# EAGLE design Adafruit RGB Matrix FeatherWing (EAGLE 9.0.1)
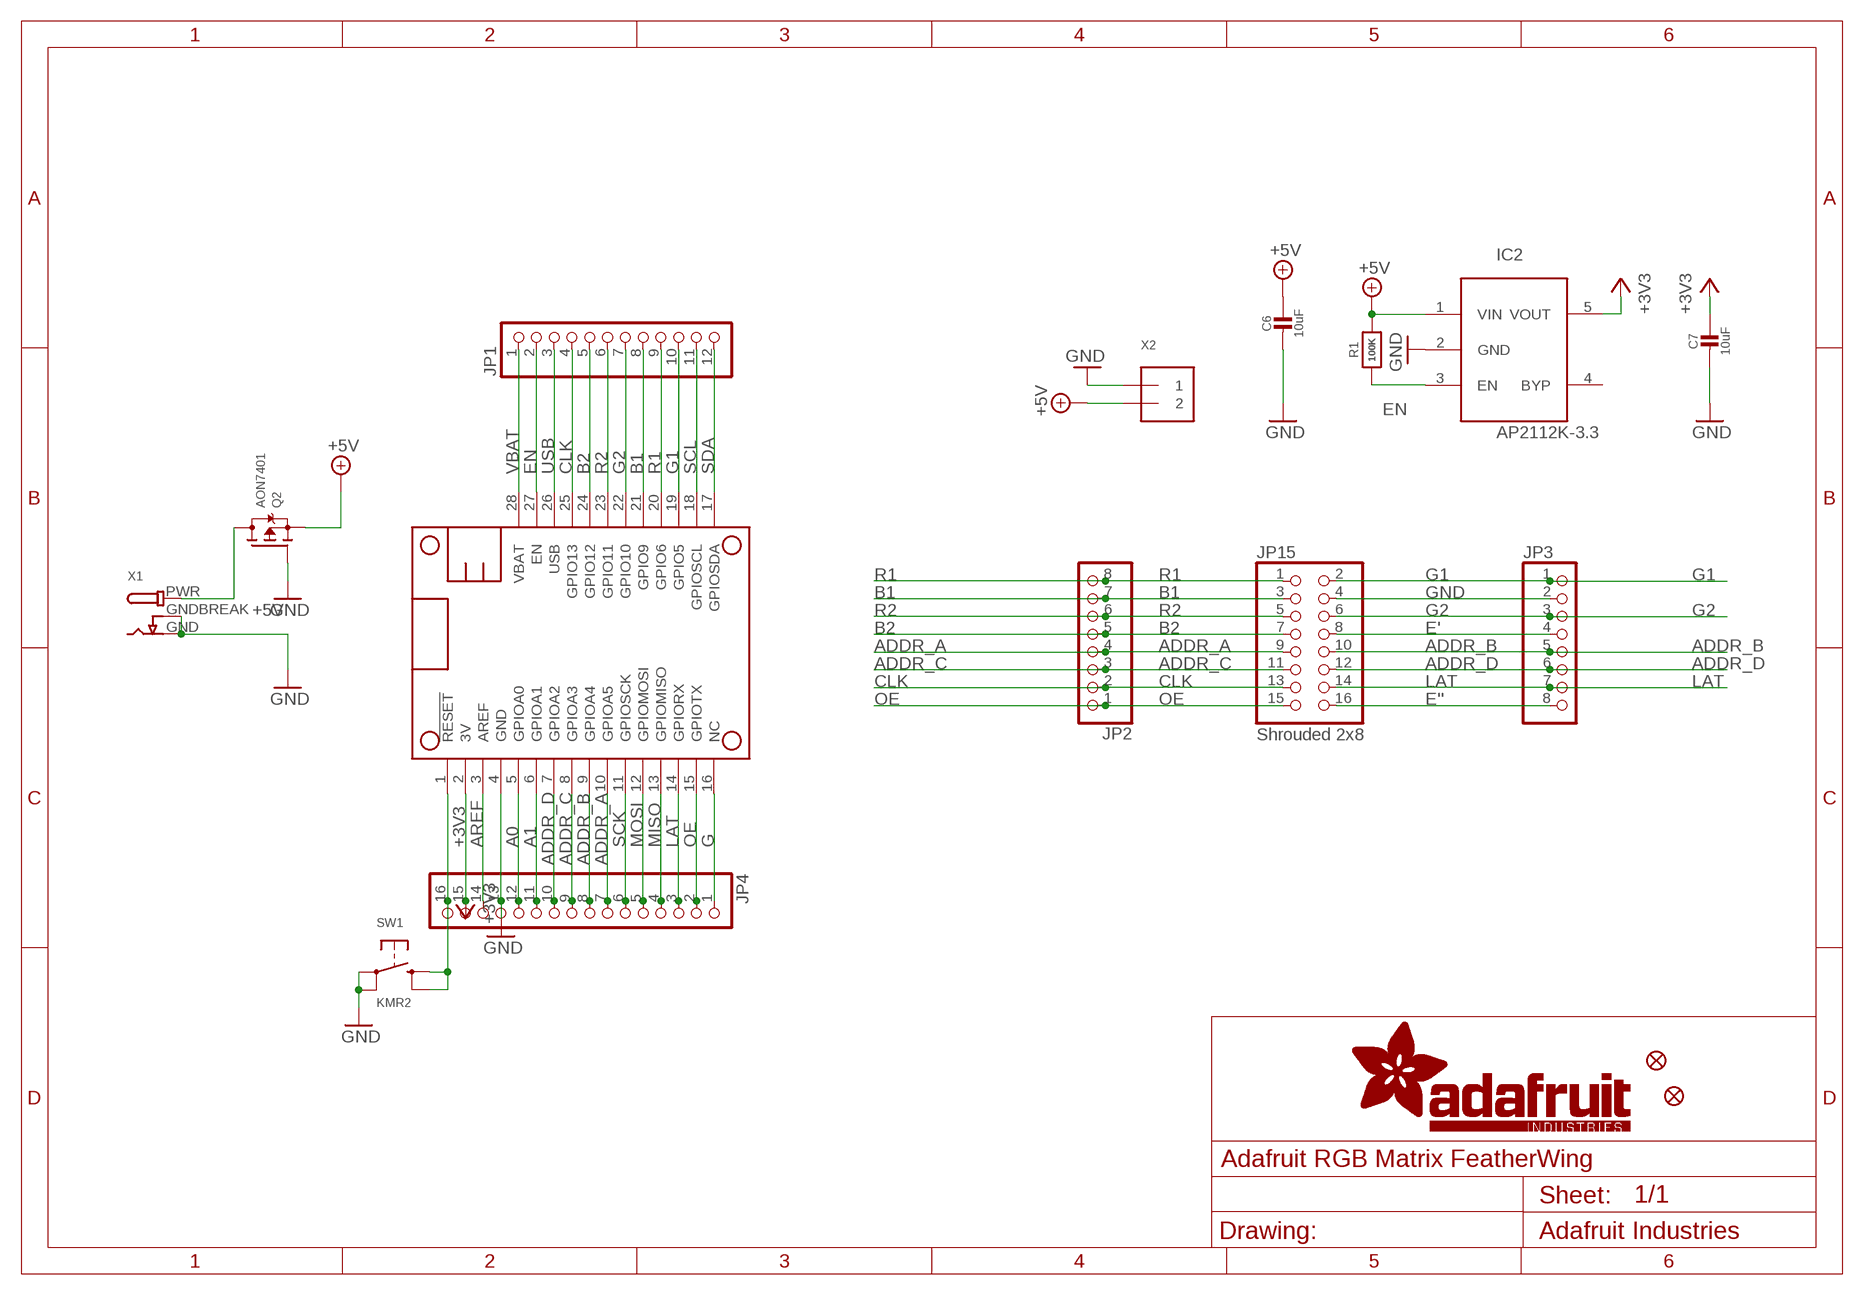
[diagram p0: schematic, sheet 1]

## Parts
C6  10uF  CAP_CERAMIC0805-NOOUTLINE  [0805-NO]
C7  10uF  CAP_CERAMIC0805-NOOUTLINE  [0805-NO]
FID1  FIDUCIAL_1MM  [FIDUCIAL_1MM]
FID3  FIDUCIAL_1MM  [FIDUCIAL_1MM]
IC2  AP2112K-3.3  LP298XS  [SOT23-5L]
JP1  HEADER-1X12  [1X12_ROUND]
JP2  HEADER-1X870MIL  [1X08_ROUND_70]
JP3  HEADER-1X870MIL  [1X08_ROUND_70]
JP4  HEADER-1X16ROUND  [1X16_ROUND]
JP15  Shrouded 2x8  HEADER-2X8_SHROUDED  [2X08_SHROUDED]
MS1  FEATHERWING  [FEATHERWING]
Q2  AON7401  MOSFET-P-POWERDI3333  [POWERDI3333]
R1  100K  RESISTOR_0603_NOOUT  [0603-NO]
SW1  KMR2  SWITCH_TACT_SMT4.6X2.8  [BTN_KMR2_4.6X2.8]
X1  DCBARRELPTH  [DCJACK_2MM_PTH]
X2  TERMBLOCK_1X2_5.08MM  [TERMBLOCK_508_1X2]

## Nets
+3V3 [power]: C7.1 IC2.5(VOUT) JP4.15 MS1.2(3V)
+5V: C6.1 IC2.1(VIN) Q2.1(S) Q2.2(S) Q2.3(S) R1.2 X2.P$4
A0: JP4.12 MS1.5(GPIOA0)
A1: JP4.11 MS1.6(GPIOA1)
ADDR_A: JP2.4 JP4.7 JP15.9 MS1.10(GPIOA5)
ADDR_B: JP3.5 JP4.8 JP15.10 MS1.9(GPIOA4)
ADDR_C: JP2.3 JP4.9 JP15.11 MS1.8(GPIOA3)
ADDR_D: JP3.6 JP4.10 JP15.12 MS1.7(GPIOA2)
AREF: JP4.14 MS1.3(AREF)
B1: JP1.8 JP2.7 JP15.3 MS1.21(GPIO9)
B2: JP1.5 JP2.5 JP15.7 MS1.24(GPIO12)
CLK: JP1.4 JP2.2 JP15.13 MS1.25(GPIO13)
E': JP3.4 JP15.8
E'': JP3.8 JP15.16
EN: IC2.3(EN) JP1.2 MS1.27(EN) R1.1
G: JP4.1 MS1.16(NC)
G1: JP1.10 JP3.1 JP15.2 MS1.19(GPIO5)
G2: JP1.7 JP3.3 JP15.6 MS1.22(GPIO10)
GND: C6.2 C7.2 IC2.2(GND) JP3.2 JP4.13 JP15.4 MS1.4(GND) Q2.4(G) SW1.A'(P1) SW1.A(P) X1.GND X1.GNDBREAK X2.P$3
LAT: JP3.7 JP4.3 JP15.14 MS1.14(GPIORX)
MISO: JP4.4 MS1.13(GPIOMISO)
MOSI: JP4.5 MS1.12(GPIOMOSI)
OE: JP2.1 JP4.2 JP15.15 MS1.15(GPIOTX)
R1: JP1.9 JP2.8 JP15.1 MS1.20(GPIO6)
R2: JP1.6 JP2.6 JP15.5 MS1.23(GPIO11)
RESET: JP4.16 MS1.1(!RESET) SW1.B'(S1) SW1.B(S)
SCK: JP4.6 MS1.11(GPIOSCK)
SCL: JP1.11 MS1.18(GPIOSCL)
SDA: JP1.12 MS1.17(GPIOSDA)
USB: JP1.3 MS1.26(USB)
VBAT: JP1.1 MS1.28(VBAT)
VIN: Q2.5678(D) X1.PWR
Unconnected: IC2.4(BYP)

## Library data of the parts
C6 C7 = microbuilder:CAP_CERAMIC: Ceramic Capacitors For new designs, use the packages preceded by an '_' character since they are more reliable: The following footprints should be used on most boards: _0402 - Standard footprint for regular board layouts _0603 - Standard footprint for regular board layouts _0805 - Standard footprint for regular board layouts _1206 - Standard footprint for regular board layouts For extremely tight-pitch boards where space is at a premium, the following 'micro-pitch' footprints can be used (smaller pads, no silkscreen outline, etc.): _0402MP - Micro-pitch footprint for very dense/compact boards _0603MP - Micro-pitch footprint for very dense/compact boards _0805MP - Micro-pitch footprint for very dense/compact boards _1206MP - Micro-pitch footprint for very dense/compact boards
FID1 FID3 = microbuilder:FIDUCIAL: Fiducial Alignment Points Various fiducial points for machine vision alignment.; BOM: EXCLUDE
IC2 = adafruit:LP298X
JP1 = microbuilder:HEADER-1X12
JP2 JP3 = microbuilder:HEADER-1X8: PIN HEADER
JP4 = microbuilder:HEADER-1X16: PIN HEADER
JP15 = microbuilder:HEADER-2X8
MS1 = microbuilder:FEATHERWING
Q2 = microbuilder:MOSFET-P: P-Channel Mosfet LEGEND VDS: Voltage Drain-Source ID: Drain Current RDS(ON): Drain-Source On-State Resistance VGS(TH): Gate-Source Threshold Voltage CISS: Drain-Source Input Capacitance SOT-23 Name VDS ID RDS(ON) VGS(TH) CISS Order Number IRLML5103 30V 760mA 600 mOhm -- 75pF @ 25V Digikey: IRLML5103PBFCT-ND IRLML6401 12V 4.3A 50 mOhm 950mV @ 250µA 830pF @ 10V Digikey: IRLML6401PBFTR-ND NTR0202PL 20V 400mA 800 mOhm 2.3V @ 250uA 70pF @ 5V Digikey: NTR0202PLT1GOSTR-ND NTR4101PT1G 20V 1.8A 85 mOhm 1.2V @ 250uA 675pF @ 10V Digikey: NTR4101PT1GOSCT-ND DMP2004K 20V 600mA 900 mOhm 1V @ 250uA 175pF @ 16V Digikey: DMP2004KDICT-ND PMV65XP 20V 3.9A 76 mOhm 950mV @ 1mA 725pF @ 20V Digikey: 568-2358-2-ND TO-252 Name VDS ID RDS(ON) VGS(TH) CISS Order Number AOD417 30V 25A 34 mOhm 3V @ 250µA 920pF @ 15V Digikey: 785-1106-2-ND PowerPak Name VDS ID RDS(ON) VGS(TH) CISS Order Number AON7401 30V 12A 14 mOhm 3V @ 250µA 2600pF @ 15V Digikey: 785-1302-1-ND
R1 = microbuilder:RESISTOR: Resistors For new designs, use the packages preceded by an '_' character since they are more reliable: The following footprints should be used on most boards: _0402 - Standard footprint for regular board layouts _0603 - Standard footprint for regular board layouts _0805 - Standard footprint for regular board layouts _1206 - Standard footprint for regular board layouts For extremely tight-pitch boards where space is at a premium, the following 'micro-pitch' footprints can be used (smaller pads, no silkscreen outline, etc.): _0402MP - Micro-pitch footprint for very dense/compact boards _0603MP - Micro-pitch footprint for very dense/compact boards _0805MP - Micro-pitch footprint for very dense/compact boards _1206MP - Micro-pitch footprint for very dense/compact boards
SW1 = microbuilder:SWITCH_TACT_SMT: SMT Tact Switches 6x6mm - Digikey: P12940SCT-ND KMR2 (4.6x2.8mm) - Digikey: 401-1426-1-ND EVQ-PQHB55 - Light Touch, 160GF (4.5x4.5mm) - Digikey: P8090SCT-ND KMT0 - KMT021 NGJ LHS (etc.) IP68/Waterproof - Digikey: CKN10289CT-ND
X1 = microbuilder:DCBARREL: DC Barrel Jack DCJACK_1.3MM_PTH - Through Hole 1.3mm Jack (4UConnector: 05536) DCJACK_2MM_PTH - Through Hole 2.0/2.1 Jack (4UConnector: 05537) DCJACK_2MM_SMT - SMT 2.0/2.1mm Jack(4UConnector: 03267)
X2 = microbuilder:TERMBLOCK_1X2: 3.5mm Terminal block http://www.ladyada.net/library/pcb/eaglelibrary.html

## Net classes
1 power: width 0.305 mm
2 thickpower: width 0.406 mm

## Board
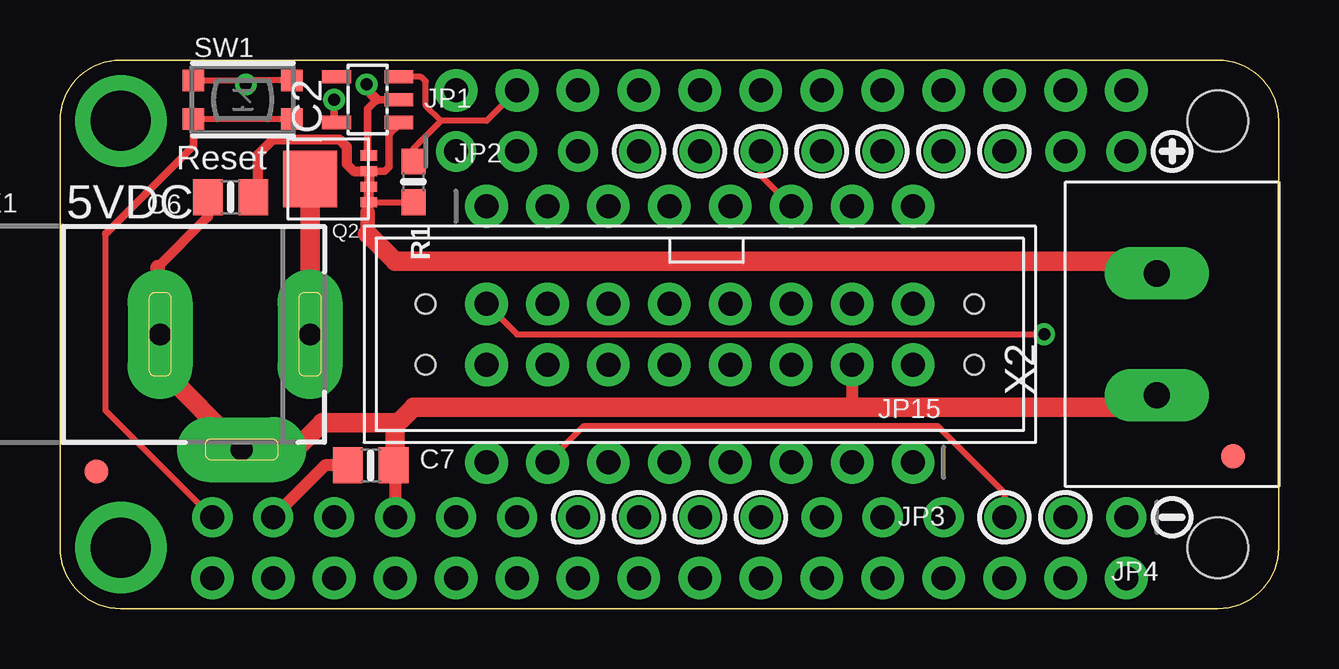
[diagram p1: board, top side]
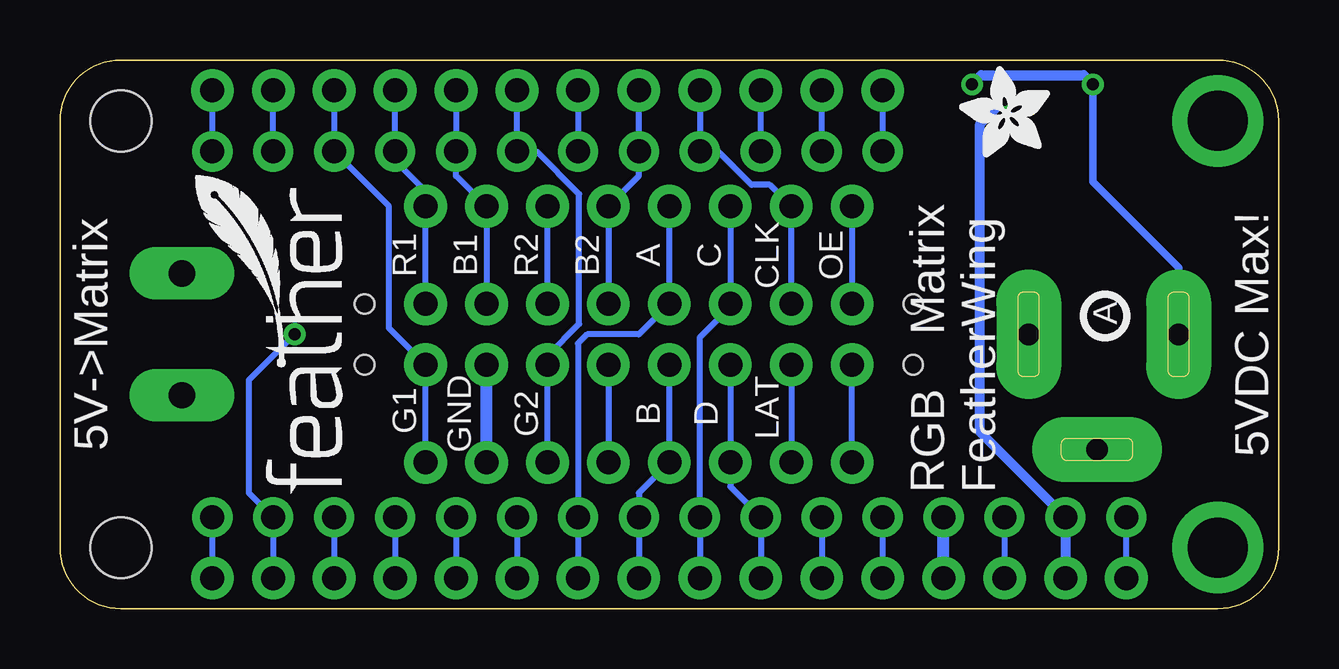
[diagram p2: board, bottom side, seen from below]

Size 50.8 x 22.86 mm. Coordinates in mm from the lower left corner, seen from the top.
Outline: 2.54,22.86 48.26,22.86 arc-90 50.8,20.32 50.8,2.54 arc-90 48.26,0 2.54,0 arc-90 0,2.54 0,20.32 arc-90 2.54,22.86
Copper layers (1*16): Top 0.035mm / dielectric 1.5mm / Bottom 0.035mm
Design rules "adafruit *": minimum track width 8mil, minimum drill 15.5mil, track to track 8mil, track to pad 8mil, pad to pad 8mil, via to via 8mil, smd to smd 8mil, copper to edge 10mil, drill to drill 8mil, minimum pad ring 10mil, minimum via ring 8mil, stop-mask expansion 2mil, vias tented up to drill 20mil, thermal gap 10mil
Holes 0.8 mm at 15.24,12.7 15.24,10.16 38.1,12.7 38.1,10.16
bRestrict: area 17.5,3.2 to 18,3.3

### Footprints (pad centres in the part's own frame; a part is rotated, then mirrored left to right if it is on the bottom)
0805-NO = smd 1.24 x 1.5: 1 -0.95,0; 2 0.95,0
FIDUCIAL_1MM = smd 1 x 1: 1 0,0
SOT23-5L = smd 0.55 x 1.2: 1 -0.95,-1.3; 2 0,-1.3; 3 0.95,-1.3; 4 0.95,1.3; 5 -0.95,1.3
1X12_ROUND = drill 1 pad 1.676: 1 -13.97,0; 2 -11.43,0; 3 -8.89,0; 4 -6.35,0; 5 -3.81,0; 6 -1.27,0; 7 1.27,0; 8 3.81,0; 9 6.35,0; 10 8.89,0; 11 11.43,0; 12 13.97,0
1X08_ROUND_70 = drill 1 pad 1.778: 1 -8.89,0; 2 -6.35,0; 3 -3.81,0; 4 -1.27,0; 5 1.27,0; 6 3.81,0; 7 6.35,0; 8 8.89,0
1X16_ROUND = drill 1 pad 1.676: 1 -19.05,0; 2 -16.51,0; 3 -13.97,0; 4 -11.43,0; 5 -8.89,0; 6 -6.35,0; 7 -3.81,0; 8 -1.27,0; 9 1.27,0; 10 3.81,0; 11 6.35,0; 12 8.89,0; 13 11.43,0; 14 13.97,0; 15 16.51,0; 16 19.05,0
2X08_SHROUDED = drill 1 pad 1.778: 1 -8.89,-1.27; 2 -8.89,1.27; 3 -6.35,-1.27; 4 -6.35,1.27; 5 -3.81,-1.27; 6 -3.81,1.27; 7 -1.27,-1.27; 8 -1.27,1.27; 9 1.27,-1.27; 10 1.27,1.27; 11 3.81,-1.27; 12 3.81,1.27; 13 6.35,-1.27; 14 6.35,1.27; 15 8.89,-1.27; 16 8.89,1.27
FEATHERWING = drill 1 pad 1.778: 1 6.35,1.27; 2 8.89,1.27; 3 11.43,1.27; 4 13.97,1.27; 5 16.51,1.27; 6 19.05,1.27; 7 21.59,1.27; 8 24.13,1.27; 9 26.67,1.27; 10 29.21,1.27; 11 31.75,1.27; 12 34.29,1.27; 13 36.83,1.27; 14 39.37,1.27; 15 41.91,1.27; 16 44.45,1.27; 17 44.45,21.59; 18 41.91,21.59; 19 39.37,21.59; 20 36.83,21.59; 21 34.29,21.59; 22 31.75,21.59; 23 29.21,21.59; 24 26.67,21.59; 25 24.13,21.59; 26 21.59,21.59; 27 19.05,21.59; 28 16.51,21.59 | drill 2.5 pad 3.81: P$1 2.54,20.32; P$2 2.54,2.54 | hole 2.54: 48.26,20.32; 48.26,2.54
POWERDI3333 = smd 0.7 x 0.42: 1 -1.7,0.975; 2 -1.7,0.325; 3 -1.7,-0.325; 4 -1.7,-0.975 | smd 2.25 x 2.35: 5678 0.75,0
0603-NO = smd 1.075 x 1: 1 -0.85,0; 2 0.85,0
BTN_KMR2_4.6X2.8 = smd 0.9 x 0.9: A 2.05,0.8; A' -2.05,0.8; B 2.05,-0.8; B' -2.05,-0.8
DCJACK_2MM_PTH = drill 0.9 pad 2.7 long: GND 7.35,0; GNDBREAK 10.75,-4.8; PWR 13.6,0
TERMBLOCK_508_1X2 = drill 1.1 pad 2.184 long: P$3 -2.54,0; P$4 2.54,0

### Placement (x,y rotation side)
C6  7.11,17.14 180 top
C7  12.95,5.97 0 top
FID1  48.9,6.35 0 top
FID3  1.52,5.71 0 top
IC2  12.83,21.21 90 top
JP1  30.48,19.05 0 top
JP2  26.67,16.76 0 top
JP3  26.67,6.1 180 top
JP4  25.4,3.81 180 top
JP15  26.67,11.43 180 top
MS1  0,0 0 top
Q2  11.18,17.91 180 top
R1  14.73,17.78 270 top
SW1  7.62,21.21 0 top
U$1  [SYMBOL_PLUS]  46.35,19.05 0 top
U$2  [PCBFEAT-REV-040]  7.24,12.19 90 bottom
U$3  [FEATHERLOGO_SMALL]  38.99,4.7 90 bottom
U$6  [SYMBOL_MINUS]  46.35,3.81 0 top
U$7  [ADAFRUIT_3.5MM]  9.53,18.8 90 bottom
X1  -3.17,11.43 0 top
X2  45.72,11.43 90 top

### Tracks (layer width: path | path; a pad name or v marks a point on that pad's centre or on a via)
+3V3  (via drill 0.5)
  Top 0.305: IC2.5 11.43,20.36 v11.43,21.21
  Top 0.508: C7.1 11.05,5.97 JP4.15
  Bottom 0.406: MS1.2 JP4.15 12.45,7.37 12.45,20.19 v11.43,21.21
+5V
  Top 0.254: 13,16.93 R1.2
  Top 0.305: Q2.3 13.53,18.23 13.72,18.41 13.72,19.78 14.13,20.19 IC2.1
  Top 0.406: 15.81,14.67 16,14.48 | Q2.1 Q2.2 Q2.3 12.25,18.23 11.96,18.52 11.96,19.25 11.65,19.55 9.05,19.55 9.05,19.56 8.89,19.56 8.26,18.92 8.26,17.34 C6.1 | 12.83,16.51 12.83,16.88 Q2.1 | Q2.1 13,16.93
  Top 0.61: 12.83,15.62 12.83,16.51
  Top 0.813: X2.P$4 45.21,14.48 16,14.48 13.97,14.48 12.83,15.62
A0
  Bottom 0.254: JP4.12 MS1.5
A1
  Bottom 0.254: JP4.11 MS1.6
ADDR_A
  Bottom 0.254: JP15.9 JP2.4 | 25.4,12.19 JP15.9 | MS1.10 JP4.7 29.21,11.05 28.83,11.43 26.67,11.43 JP15.9
ADDR_B
  Bottom 0.254: JP15.10 JP3.5 26.29,5.21 26.67,4.83 JP4.8 MS1.9
ADDR_C
  Bottom 0.254: JP2.3 JP15.11 22.85,12.7 22.79,12.64 24.13,11.3 JP4.9 MS1.8
ADDR_D
  Bottom 0.254: JP15.12 JP3.6 22.86,5.08 JP4.10 MS1.7
AREF
  Bottom 0.254: JP4.14 MS1.3
B1
  Bottom 0.254: JP15.3 JP2.7 34.29,18.03 JP1.8 MS1.21
B2
  Bottom 0.254: JP15.7 JP2.5 26.67,18.03 JP1.5 MS1.24
CLK
  Bottom 0.254: JP15.13 JP2.2 21.21,17.65 21.97,17.65 23.37,19.05 JP1.4 MS1.25
E'
  Bottom 0.254: JP15.8 JP3.4
E''
  Bottom 0.254: JP3.8 JP15.16
EN
  Top 0.254: MS1.27 17.78,20.32 15.88,20.32 | 15.88,20.32 15.24,20.95 15.24,21.97 15.05,22.16 IC2.3 | R1.1 14.73,19.18 15.88,20.32
  Bottom 0.254: JP1.2 MS1.27
G
  Bottom 0.254: JP4.1 MS1.16
G1
  Bottom 0.254: JP3.1 JP15.2 37.08,11.68 37.08,16.76 JP1.10 MS1.19
G2
  Bottom 0.254: JP3.3 JP15.6 30.48,10.54 29.16,11.86 29.16,17.27 30.94,19.05 JP1.7 MS1.22
GND  (via drill 0.5)
  Top 0.254: SW1.A' 7.75,22.01 SW1.A | C7.2 13.97,5.9 13.97,5.84
  Top 0.305: 9.87,22.01 SW1.A | 7.75,22.01 v7.75,21.84 | IC2.2 13.21,21.21 12.83,20.83 12.83,19.05 12.88,19 Q2.4 12.74,18.88
  Top 0.406: 13.21,21.21 12.78,21.63 v12.78,21.84 | C6.2 6.16,16.32 4.06,14.22
  Top 0.508: JP15.4 33.02,8.38 | 13.97,5.84 JP4.13 | C7.2 13.97,6.04
  Top 0.61: 4.17,10.66 X1.GND 4.06,11.54 4.06,14.22 | 13.84,7.75 13.97,7.62
  Top 0.813: 13.97,6.04 13.97,7.62 14.73,8.38 33.02,8.38 45.21,8.38 X2.P$3 | 13.84,7.75 10.92,7.75 9.8,6.63 X1.GNDBREAK 4.17,10.03 4.17,10.66
  Bottom 0.305: 4.13,11.47 X1.GND 4.17,14.21 7.75,17.78 v7.75,21.84
  Bottom 0.406: v12.78,21.84 12.4,22.23 8.13,22.23 v7.75,21.84
  Bottom 0.508: MS1.4 JP4.13 | JP3.2 JP15.4
LAT
  Top 0.254: JP3.7 21.84,7.62 36.58,7.62 39.37,4.83 JP4.3
  Bottom 0.254: JP15.14 JP3.7 | JP4.3 MS1.14
MISO
  Bottom 0.254: JP4.4 MS1.13
MOSI
  Bottom 0.254: JP4.5 MS1.12
OE  (via drill 0.5)
  Top 0.254: JP15.15 19.05,11.43 v41.02,11.43
  Bottom 0.254: JP2.1 JP15.15 | MS1.15 JP4.2 42.93,4.83 42.93,9.53 v41.02,11.43
R1
  Bottom 0.254: JP15.1 JP2.8 35.56,17.4 36.83,18.67 JP1.9 MS1.20
R2
  Top 0.254: JP2.6 29.21,18.03 JP1.6
  Bottom 0.254: JP15.5 JP2.6 | MS1.23 JP1.6
RESET
  Top 0.254: SW1.B' SW1.B | JP4.16 1.91,8.26 1.91,15.62
  Top 0.305: 1.91,15.62 5.57,19.29 SW1.B'
  Bottom 0.254: MS1.1 JP4.16
SCK
  Bottom 0.254: JP4.6 MS1.11
SCL
  Bottom 0.254: JP1.11 MS1.18
SDA
  Bottom 0.254: MS1.17 JP1.12
USB
  Bottom 0.254: JP1.3 MS1.26
VBAT
  Bottom 0.254: MS1.28 JP1.1
VIN
  Top 0.813: Q2.5678 X1.PWR

### Text on the board
tPlace: Reset | 5VDC
bPlace: OE | CLK | C | A | B2 | R2 | B1 | R1 | 5VDC Max! | 5V->Matrix | LAT | D | B | G2 | GND | G1 | RGB Matrix / FeatherWing